# EAGLE design IO_BOARD_1 (EAGLE 5.01)

## Sheet 1 of 2
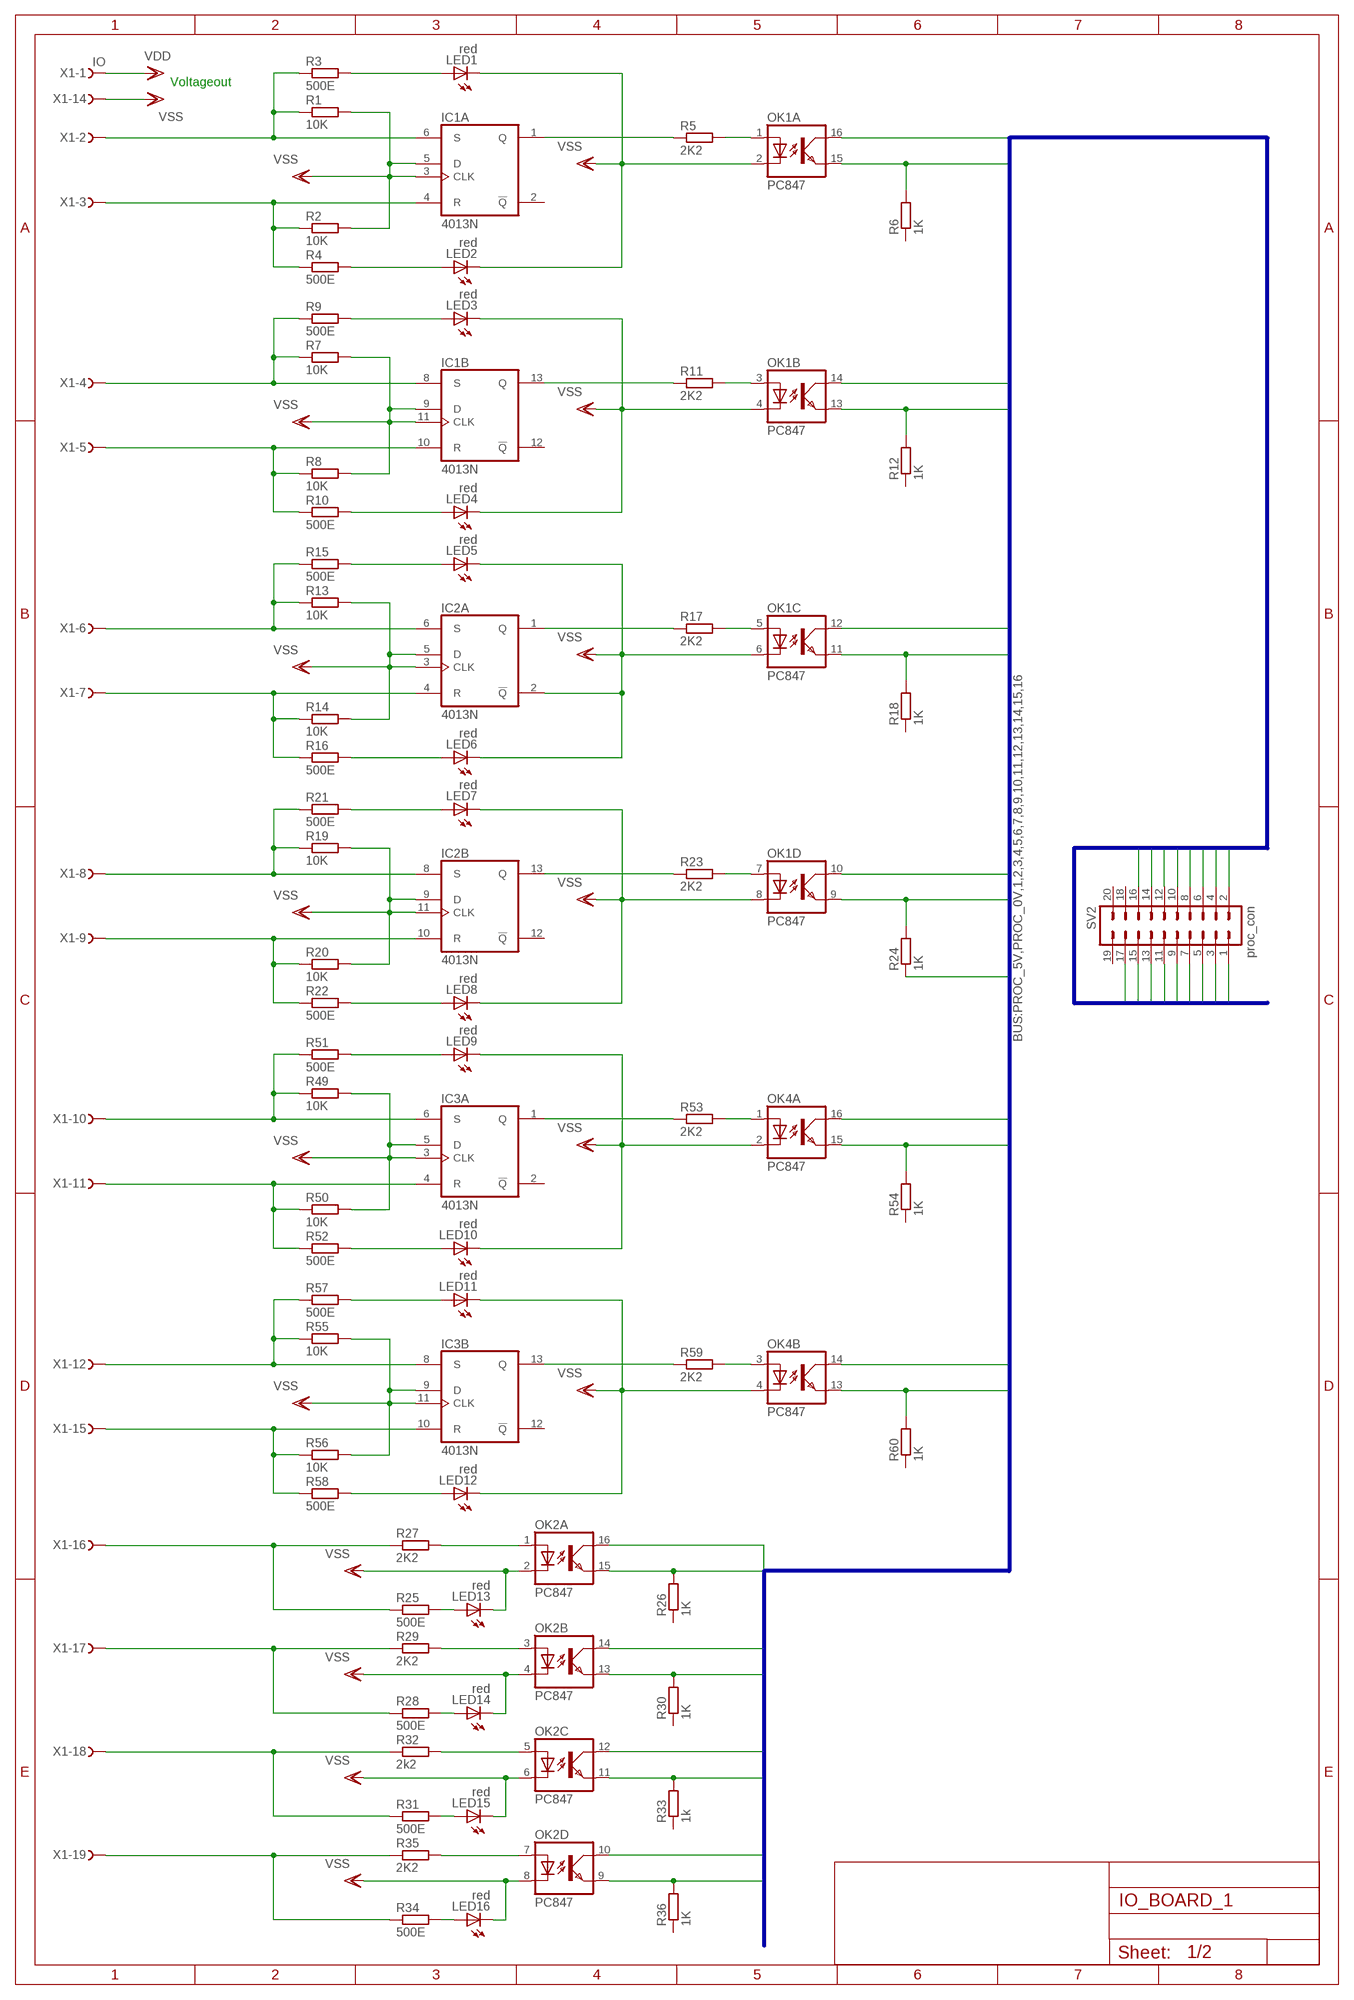
[diagram p0: schematic, sheet 1]

### Parts
IC1  4013N  [DIL14]
IC2  4013N  [DIL14]
IC3  4013N  [DIL14]
LED1  red  LED3MM  [LED3MM]
LED2  red  LED3MM  [LED3MM]
LED3  red  LED3MM  [LED3MM]
LED4  red  LED3MM  [LED3MM]
LED5  red  LED3MM  [LED3MM]
LED6  red  LED3MM  [LED3MM]
LED7  red  LED3MM  [LED3MM]
LED8  red  LED3MM  [LED3MM]
LED9  red  LED3MM  [LED3MM]
LED10  red  LED3MM  [LED3MM]
LED11  red  LED3MM  [LED3MM]
LED12  red  LED3MM  [LED3MM]
LED13  red  LED3MM  [LED3MM]
LED14  red  LED3MM  [LED3MM]
LED15  red  LED3MM  [LED3MM]
LED16  red  LED3MM  [LED3MM]
OK1  PC847  [DIL16]
OK2  PC847  [DIL16]
OK4  PC847  [DIL16]
R1  10K  R-EU_0207/10  [0207/10]
R2  10K  R-EU_0207/10  [0207/10]
R3  500E  R-EU_0207/10  [0207/10]
R4  500E  R-EU_0207/10  [0207/10]
R5  2K2  R-EU_0207/10  [0207/10]
R6  1K  R-EU_0207/10  [0207/10]
R7  10K  R-EU_0207/10  [0207/10]
R8  10K  R-EU_0207/10  [0207/10]
R9  500E  R-EU_0207/10  [0207/10]
R10  500E  R-EU_0207/10  [0207/10]
R11  2K2  R-EU_0207/10  [0207/10]
R12  1K  R-EU_0207/10  [0207/10]
R13  10K  R-EU_0207/10  [0207/10]
R14  10K  R-EU_0207/10  [0207/10]
R15  500E  R-EU_0207/10  [0207/10]
R16  500E  R-EU_0207/10  [0207/10]
R17  2K2  R-EU_0207/10  [0207/10]
R18  1K  R-EU_0207/10  [0207/10]
R19  10K  R-EU_0207/10  [0207/10]
R20  10K  R-EU_0207/10  [0207/10]
R21  500E  R-EU_0207/10  [0207/10]
R22  500E  R-EU_0207/10  [0207/10]
R23  2K2  R-EU_0207/10  [0207/10]
R24  1K  R-EU_0207/10  [0207/10]
R25  500E  R-EU_0207/10  [0207/10]
R26  1K  R-EU_0207/10  [0207/10]
R27  2K2  R-EU_0207/10  [0207/10]
R28  500E  R-EU_0207/10  [0207/10]
R29  2K2  R-EU_0207/10  [0207/10]
R30  1K  R-EU_0207/10  [0207/10]
R31  500E  R-EU_0207/10  [0207/10]
R32  2k2  R-EU_0207/10  [0207/10]
R33  1k  R-EU_0207/10  [0207/10]
R34  500E  R-EU_0207/10  [0207/10]
R35  2K2  R-EU_0207/10  [0207/10]
R36  1K  R-EU_0207/10  [0207/10]
R49  10K  R-EU_0207/10  [0207/10]
R50  10K  R-EU_0207/10  [0207/10]
R51  500E  R-EU_0207/10  [0207/10]
R52  500E  R-EU_0207/10  [0207/10]
R53  2K2  R-EU_0207/10  [0207/10]
R54  1K  R-EU_0207/10  [0207/10]
R55  10K  R-EU_0207/10  [0207/10]
R56  10K  R-EU_0207/10  [0207/10]
R57  500E  R-EU_0207/10  [0207/10]
R58  500E  R-EU_0207/10  [0207/10]
R59  2K2  R-EU_0207/10  [0207/10]
R60  1K  R-EU_0207/10  [0207/10]
SV2  proc_con  ML20  [ML20]
X1  IO  F25HPS  [F25HP]

### Nets
1: OK1.15(A:EMIT) R6.2 SV2.3
2: OK1.13(B:EMIT) R12.2 SV2.4
3: OK1.11(C:EMIT) R18.2 SV2.5
4: OK1.9(D:EMIT) R24.2 SV2.6
5: OK4.15(A:EMIT) R54.2 SV2.7
6: OK4.13(B:EMIT) R60.2 SV2.8
7: OK2.15(A:EMIT) R26.2 SV2.9
8: OK2.13(B:EMIT) R30.2 SV2.10
9: OK2.11(C:EMIT) R33.2 SV2.11
10: OK2.9(D:EMIT) R36.2 SV2.12
11: SV2.13 ; also sheet 2
12: SV2.14 ; also sheet 2
13: SV2.15 ; also sheet 2
14: SV2.16 ; also sheet 2
15: SV2.17 ; also sheet 2
N$1: IC1.6(A:S) R1.1 R3.1 X1.2(-2:F)
N$2: IC1.4(A:R) R2.1 R4.1 X1.3(-3:F)
N$3: LED1.A R3.2
N$4: LED2.A R4.2
N$5: OK1.1(A:A) R5.2
N$6: IC1.1(A:Q) R5.1
N$7: IC2.8(B:S) R19.1 R21.1 X1.8(-8:F)
N$8: IC2.10(B:R) R20.1 R22.1 X1.9(-9:F)
N$10: IC1.8(B:S) R7.1 R9.1 X1.4(-4:F)
N$11: IC1.10(B:R) R8.1 R10.1 X1.5(-5:F)
N$12: LED3.A R9.2
N$13: LED4.A R10.2
N$14: OK1.3(B:A) R11.2
N$15: IC1.13(B:Q) R11.1
N$17: IC2.6(A:S) R13.1 R15.1 X1.6(-6:F)
N$18: IC2.4(A:R) R14.1 R16.1 X1.7(-7:F)
N$19: LED5.A R15.2
N$20: LED6.A R16.2
N$21: OK1.5(C:A) R17.2
N$24: LED7.A R21.2
N$25: LED8.A R22.2
N$26: OK1.7(D:A) R23.2
N$27: IC2.13(B:Q) R23.1
N$28: IC2.1(A:Q) R17.1
N$29: OK2.1(A:A) R27.2
N$30: R25.1 R27.1 X1.16(-16:F)
N$31: OK2.3(B:A) R29.2
N$32: LED13.A R25.2
N$33: R28.1 R29.1 X1.17(-17:F)
N$35: LED14.A R28.2
N$37: OK2.5(C:A) R32.2
N$38: R31.1 R32.1 X1.18(-18:F)
N$39: LED15.A R31.2
N$41: OK2.7(D:A) R35.2
N$42: R34.1 R35.1 X1.19(-19:F)
N$43: LED16.A R34.2
N$61: IC3.6(A:S) R49.1 R51.1 X1.10(-10:F)
N$62: IC3.4(A:R) R50.1 R52.1 X1.11(-11:F)
N$63: LED9.A R51.2
N$64: LED10.A R52.2
N$65: OK4.1(A:A) R53.2
N$66: IC3.1(A:Q) R53.1
N$68: IC3.8(B:S) R55.1 R57.1 X1.12(-12:F)
N$69: IC3.10(B:R) R56.1 R58.1 X1.15(-15:F)
N$70: LED11.A R57.2
N$71: LED12.A R58.2
N$72: OK4.3(B:A) R59.2
N$73: IC3.13(B:Q) R59.1
PROC_0V: R24.1 SV2.2
PROC_5V: OK1.10(D:COL) OK1.12(C:COL) OK1.14(B:COL) OK1.16(A:COL) OK2.10(D:COL) OK2.12(C:COL) OK2.14(B:COL) OK2.16(A:COL) OK4.14(B:COL) OK4.16(A:COL) SV2.1 ; also sheet 2
VDD: X1.1(-1:F) ; also sheet 2
VSS: IC1.3(A:CLK) IC1.5(A:D) IC1.9(B:D) IC1.11(B:CLK) IC2.2(A:!Q) IC2.3(A:CLK) IC2.5(A:D) IC2.9(B:D) IC2.11(B:CLK) IC3.3(A:CLK) IC3.5(A:D) IC3.9(B:D) IC3.11(B:CLK) LED1.K(C) LED2.K(C) LED3.K(C) LED4.K(C) LED5.K(C) LED6.K(C) LED7.K(C) LED8.K(C) LED9.K(C) LED10.K(C) LED11.K(C) LED12.K(C) LED13.K(C) LED14.K(C) LED15.K(C) LED16.K(C) OK1.2(A:C) OK1.4(B:C) OK1.6(C:C) OK1.8(D:C) OK2.2(A:C) OK2.4(B:C) OK2.6(C:C) OK2.8(D:C) OK4.2(A:C) OK4.4(B:C) R1.2 R2.2 R7.2 R8.2 R13.2 R14.2 R19.2 R20.2 R49.2 R50.2 R55.2 R56.2 X1.14(-14:F) ; also sheet 2
Unconnected: IC1.2(A:!Q) IC1.12(B:!Q) IC2.12(B:!Q) IC3.2(A:!Q) IC3.12(B:!Q) R6.1 R12.1 R18.1 R26.1 R30.1 R33.1 R36.1 R54.1 R60.1 SV2.18 SV2.19 SV2.20

### Buses
BUS:PROC_5V,PROC_0V,1,2,3,4,5,6,7,8,9,10,11,12,13,14,15,16

### Notes on the sheet
- Voltageout

## Sheet 2 of 2
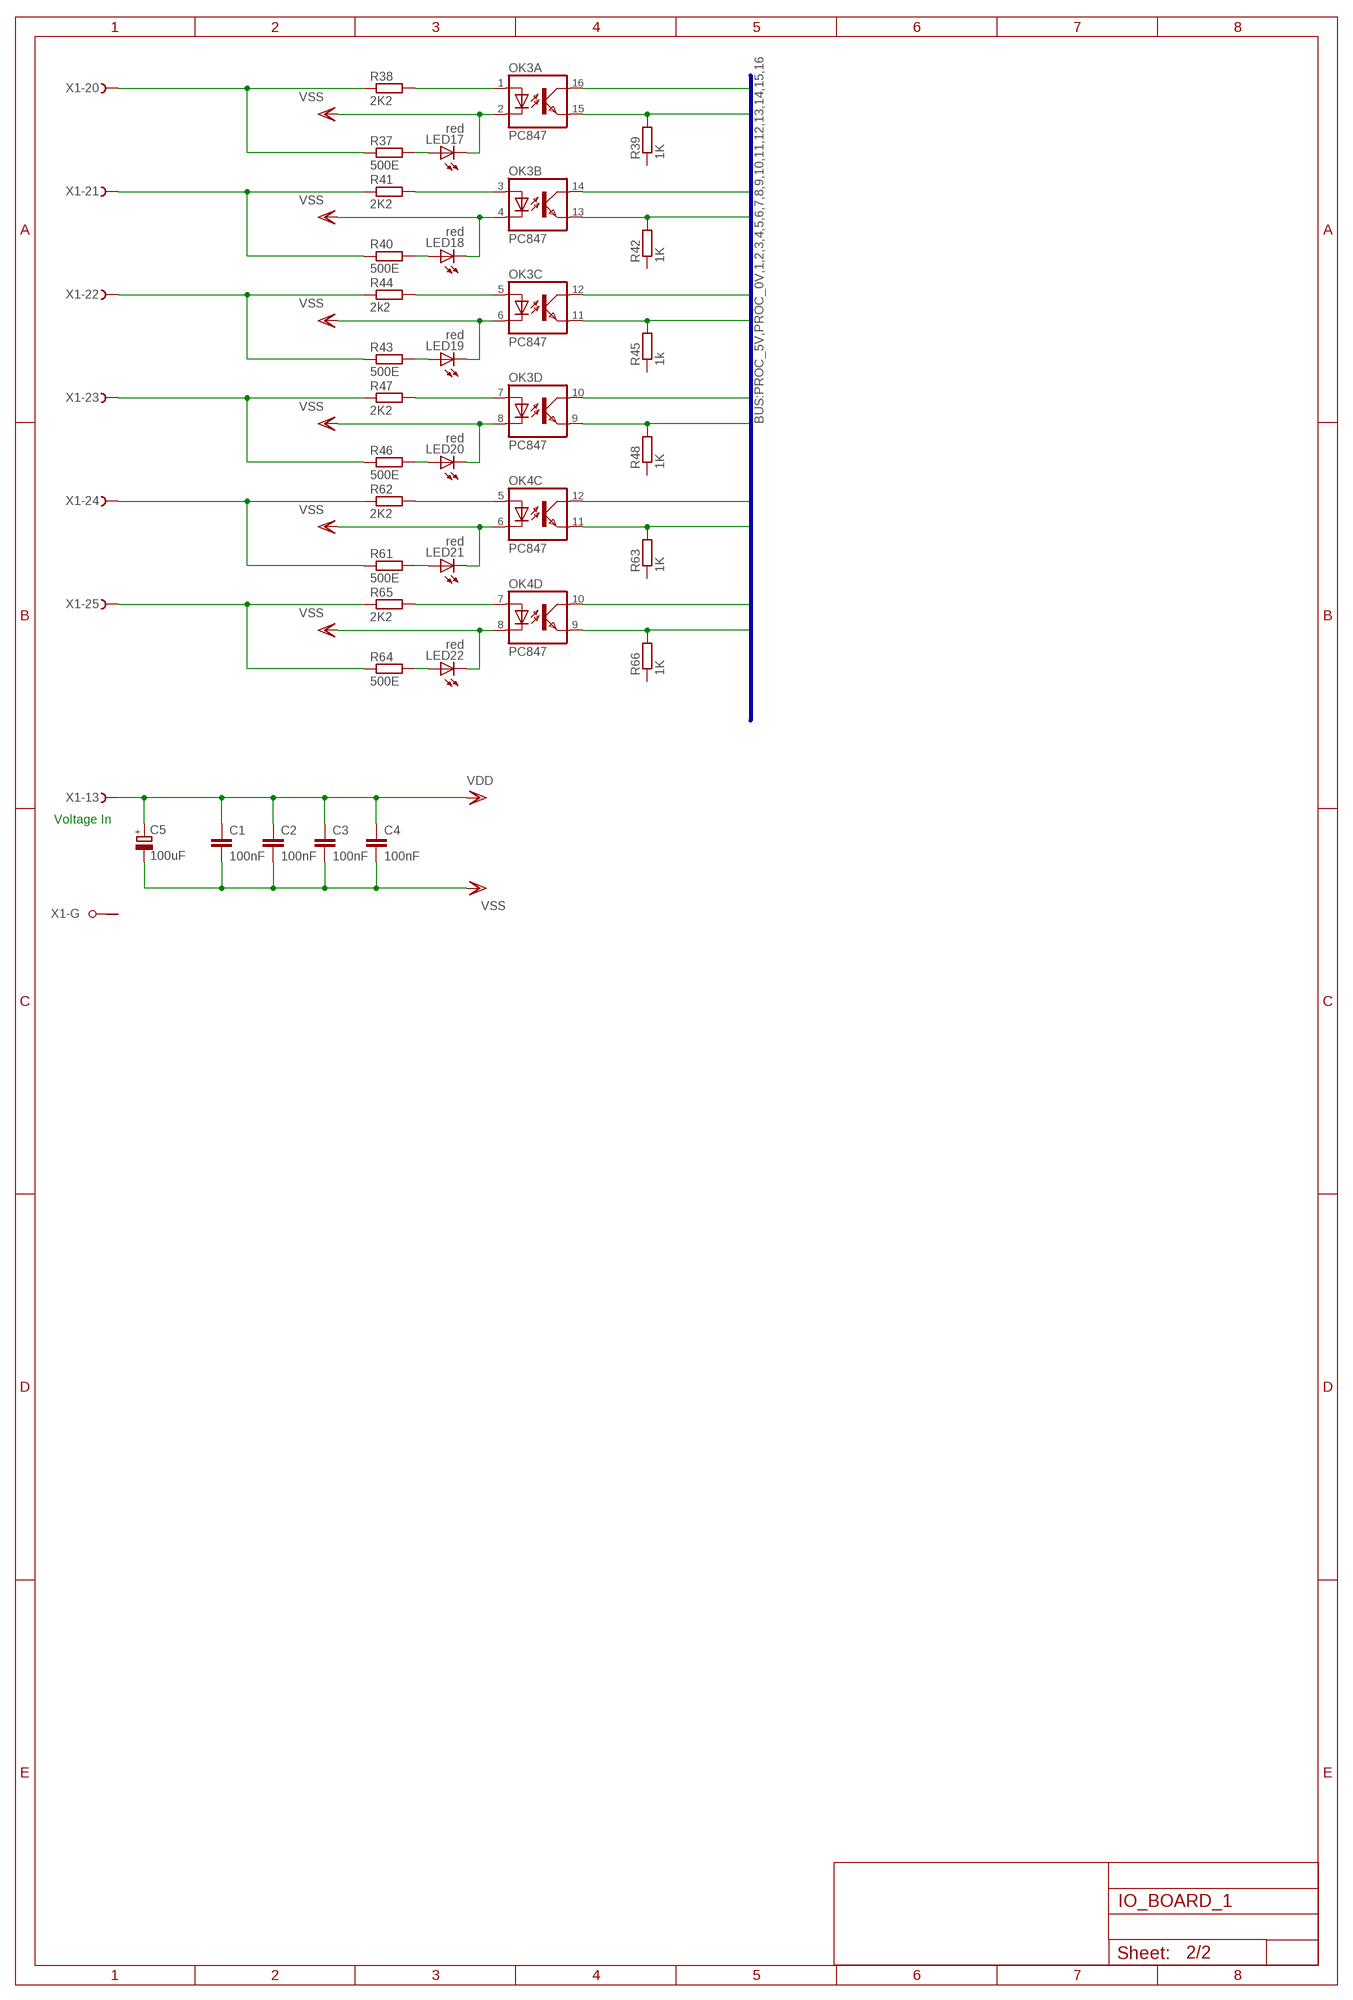
[diagram p1: schematic, sheet 2]

### Parts
C1  100nF  C-EU075-032X103  [C075-032X103]
C2  100nF  C-EU075-032X103  [C075-032X103]
C3  100nF  C-EU075-032X103  [C075-032X103]
C4  100nF  C-EU075-032X103  [C075-032X103]
C5  100uF  CPOL-EUE2.5-6  [E2,5-6]
LED17  red  LED3MM  [LED3MM]
LED18  red  LED3MM  [LED3MM]
LED19  red  LED3MM  [LED3MM]
LED20  red  LED3MM  [LED3MM]
LED21  red  LED3MM  [LED3MM]
LED22  red  LED3MM  [LED3MM]
OK3  PC847  [DIL16]
R37  500E  R-EU_0207/10  [0207/10]
R38  2K2  R-EU_0207/10  [0207/10]
R39  1K  R-EU_0207/10  [0207/10]
R40  500E  R-EU_0207/10  [0207/10]
R41  2K2  R-EU_0207/10  [0207/10]
R42  1K  R-EU_0207/10  [0207/10]
R43  500E  R-EU_0207/10  [0207/10]
R44  2k2  R-EU_0207/10  [0207/10]
R45  1k  R-EU_0207/10  [0207/10]
R46  500E  R-EU_0207/10  [0207/10]
R47  2K2  R-EU_0207/10  [0207/10]
R48  1K  R-EU_0207/10  [0207/10]
R61  500E  R-EU_0207/10  [0207/10]
R62  2K2  R-EU_0207/10  [0207/10]
R63  1K  R-EU_0207/10  [0207/10]
R64  500E  R-EU_0207/10  [0207/10]
R65  2K2  R-EU_0207/10  [0207/10]
R66  1K  R-EU_0207/10  [0207/10]

### Nets
11: OK3.15(A:EMIT) R39.2 ; also sheet 1
12: OK3.13(B:EMIT) R42.2 ; also sheet 1
13: OK3.11(C:EMIT) R45.2 ; also sheet 1
14: OK3.9(D:EMIT) R48.2 ; also sheet 1
15: OK4.11(C:EMIT) R63.2 ; also sheet 1
16: OK4.9(D:EMIT) R66.2
N$9: OK4.7(D:A) R65.2
N$16: R64.1 R65.1 X1.25(-25:F)
N$23: LED22.A R64.2
N$45: OK3.1(A:A) R38.2
N$46: R37.1 R38.1 X1.20(-20:F)
N$47: LED17.A R37.2
N$49: OK3.3(B:A) R41.2
N$50: R40.1 R41.1 X1.21(-21:F)
N$51: LED18.A R40.2
N$53: OK3.5(C:A) R44.2
N$54: R43.1 R44.1 X1.22(-22:F)
N$55: LED19.A R43.2
N$57: OK3.7(D:A) R47.2
N$58: R46.1 R47.1 X1.23(-23:F)
N$59: LED20.A R46.2
N$75: OK4.5(C:A) R62.2
N$76: R61.1 R62.1 X1.24(-24:F)
N$77: LED21.A R61.2
PROC_5V: OK3.10(D:COL) OK3.12(C:COL) OK3.14(B:COL) OK3.16(A:COL) OK4.10(D:COL) OK4.12(C:COL) ; also sheet 1
VDD: C1.1 C2.1 C3.1 C4.1 C5.+ X1.13(-13:F) ; also sheet 1
VSS: C1.2 C2.2 C3.2 C4.2 C5.- LED17.K(C) LED18.K(C) LED19.K(C) LED20.K(C) LED21.K(C) LED22.K(C) OK3.2(A:C) OK3.4(B:C) OK3.6(C:C) OK3.8(D:C) OK4.6(C:C) OK4.8(D:C) ; also sheet 1
Unconnected: R39.1 R42.1 R45.1 R48.1 R63.1 R66.1 X1.G1(-G:G1) X1.G2(-G:G2)

### Buses
BUS:PROC_5V,PROC_0V,1,2,3,4,5,6,7,8,9,10,11,12,13,14,15,16

### Notes on the sheet
- Voltage In

## Power pins joined to a net without a drawn wire
VDD: IC1.14(P:VDD) IC2.14(P:VDD) IC3.14(P:VDD)
VSS: IC1.7(P:VSS) IC2.7(P:VSS) IC3.7(P:VSS)

## Library data of the parts
C1-C4 = resistor:C-EU: CAPACITOR, European symbol
C5 = resistor:CPOL-EU: POLARIZED CAPACITOR, European symbol
IC1-IC3 = 40xx:4013: Dual D FLIP FLOP, set/reset
LED1-LED22 = led:LED: LED OSRAM: - CHIPLED LG R971, LG N971, LY N971, LG Q971, LY Q971, LO R971, LY R971 LH N974, LH R974 LS Q976, LO Q976, LY Q976 LO Q996 - Hyper CHIPLED LW Q18S LB Q993, LB Q99A, LB R99A - SideLED LS A670, LO A670, LY A670, LG A670, LP A670 LB A673, LV A673, LT A673, LW A673 LH A674 LY A675 LS A676, LA A676, LO A676, LY A676, LW A676 LS A679, LY A679, LG A679 - Hyper Micro SIDELED® LS Y876, LA Y876, LO Y876, LY Y876 LT Y87S - SmartLED LW L88C, LW L88S LB L89C, LB L89S, LG L890 LS L89K, LO L89K, LY L89K LS L896, LA L896, LO L896, LY L896 - TOPLED LS T670, LO T670, LY T670, LG T670, LP T670 LSG T670, LSP T670, LSY T670, LOP T670, LYG T670 LG T671, LOG T671, LSG T671 LB T673, LV T673, LT T673, LW T673 LH T674 LS T676, LA T676, LO T676, LY T676, LB T676, LH T676, LSB T676, LW T676 LB T67C, LV T67C, LT T67C, LS T67K, LO T67K, LY T67K, LW E67C LS E67B, LA E67B, LO E67B, LY E67B, LB E67C, LV E67C, LT E67C LW T67C LS T679, LY T679, LG T679 LS T770, LO T770, LY T770, LG T770, LP T770 LB T773, LV T773, LT T773, LW T773 LH T774 LS E675, LA E675, LY E675, LS T675 LS T776, LA T776, LO T776, LY T776, LB T776 LHGB T686 LT T68C, LB T68C - Hyper Mini TOPLED® LB M676 - Mini TOPLED Santana® LG M470 LS M47K, LO M47K, LY M47K Source: http://www.osram.convergy.de LUXEON: - LUMILED® LXK2-PW12-R00, LXK2-PW12-S00, LXK2-PW14-U00, LXK2-PW14-V00 LXK2-PM12-R00, LXK2-PM12-S00, LXK2-PM14-U00 LXK2-PE12-Q00, LXK2-PE12-R00, LXK2-PE12-S00, LXK2-PE14-T00, LXK2-PE14-U00 LXK2-PB12-K00, LXK2-PB12-L00, LXK2-PB12-M00, LXK2-PB14-N00, LXK2-PB14-P00, LXK2-PB14-Q00 LXK2-PR12-L00, LXK2-PR12-M00, LXK2-PR14-Q00, LXK2-PR14-R00 LXK2-PD12-Q00, LXK2-PD12-R00, LXK2-PD12-S00 LXK2-PH12-R00, LXK2-PH12-S00 LXK2-PL12-P00, LXK2-PL12-Q00, LXK2-PL12-R00 Source: www.luxeon.com KINGBRIGHT: KA-3528ASYC Source: www.kingbright.com
OK1-OK4 = optocoupler:PC847: SHARP OPTO COUPLER
R1-R66 = resistor:R-EU_: RESISTOR, European symbol
SV2 = con-harting-ml:ML20: HARTING
X1 = con-subd:F25HPS: SUB-D

## Board
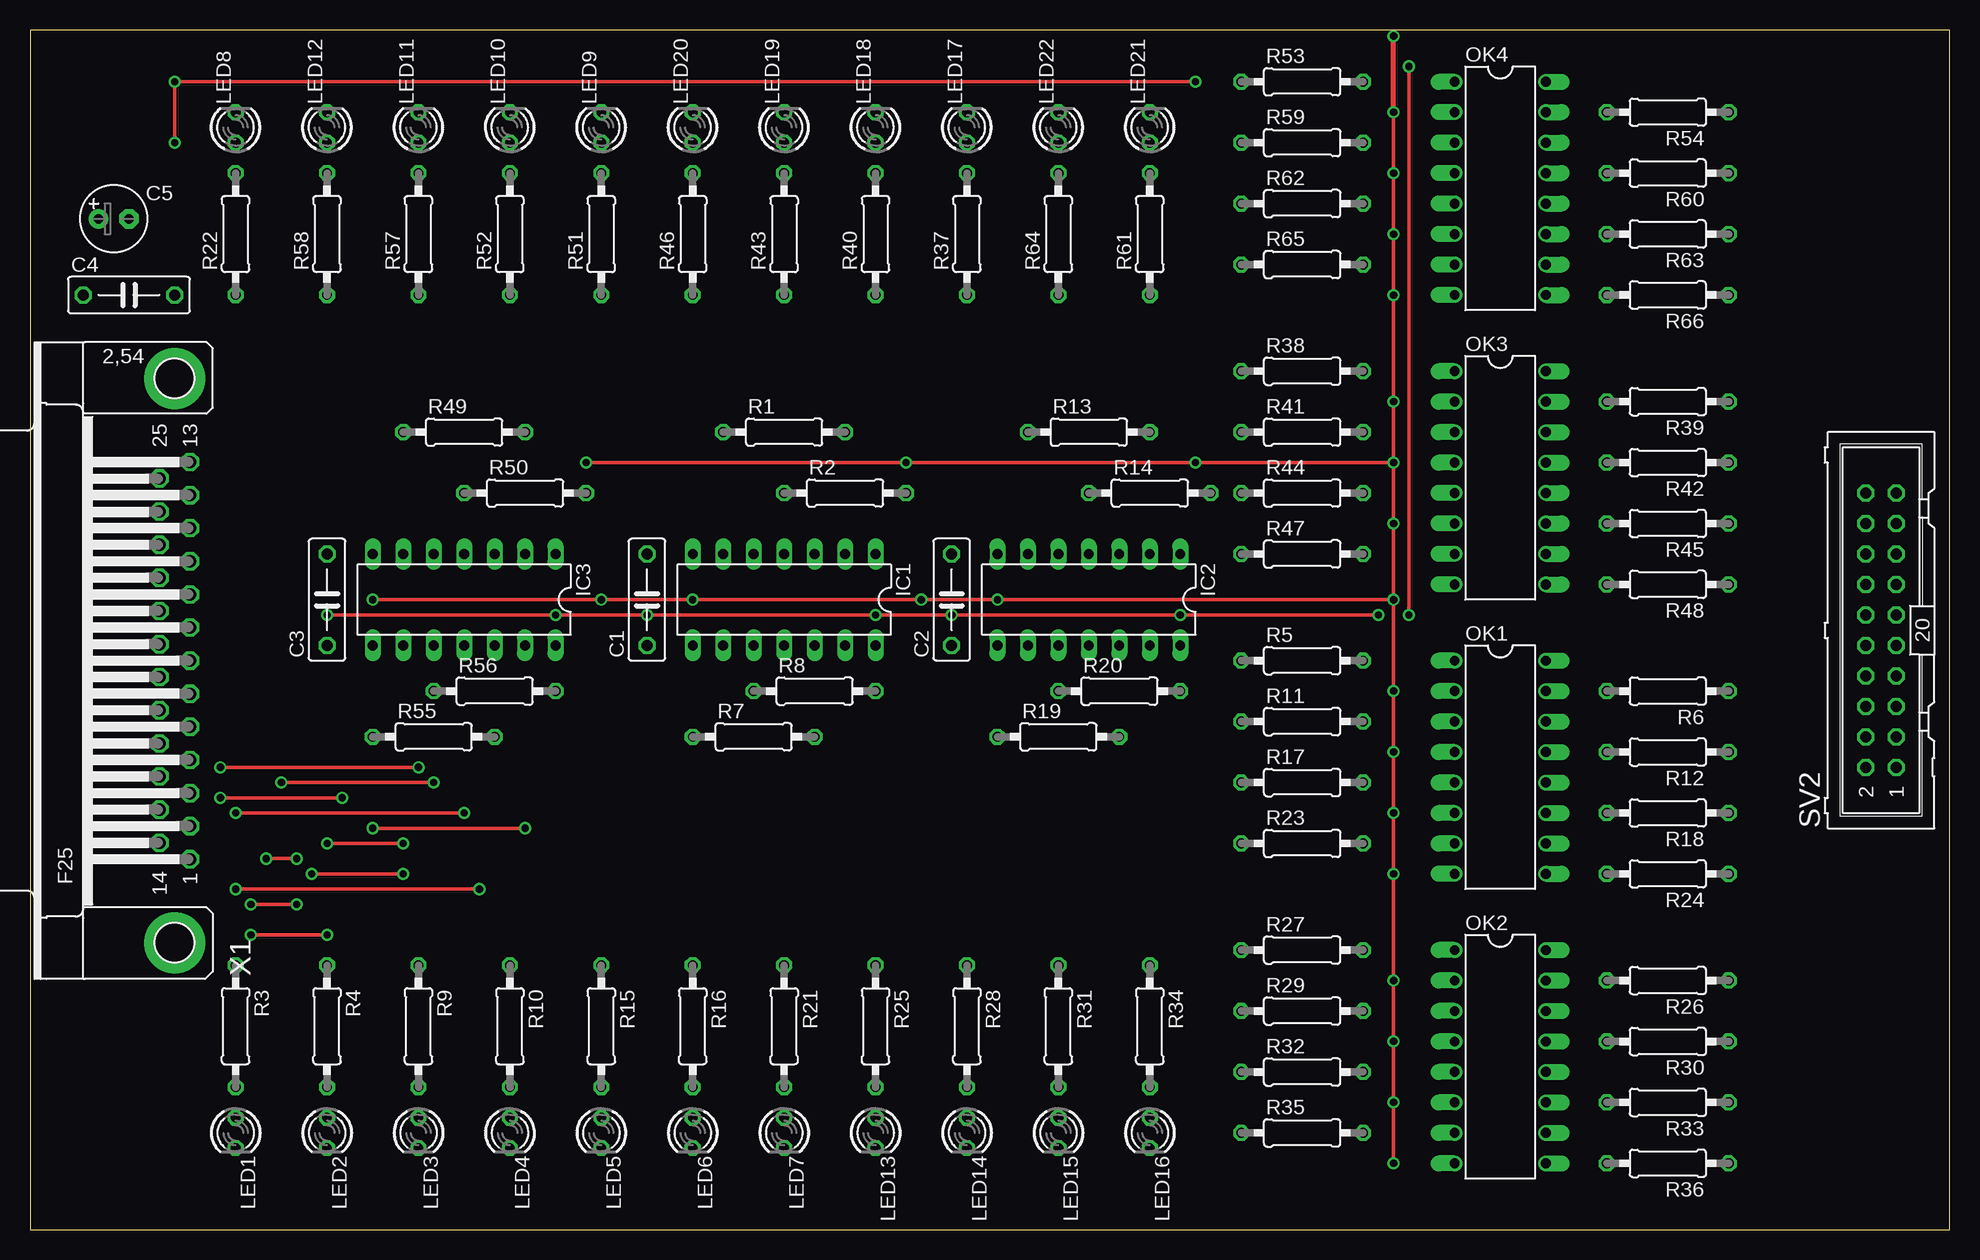
[diagram p2: board, top side]
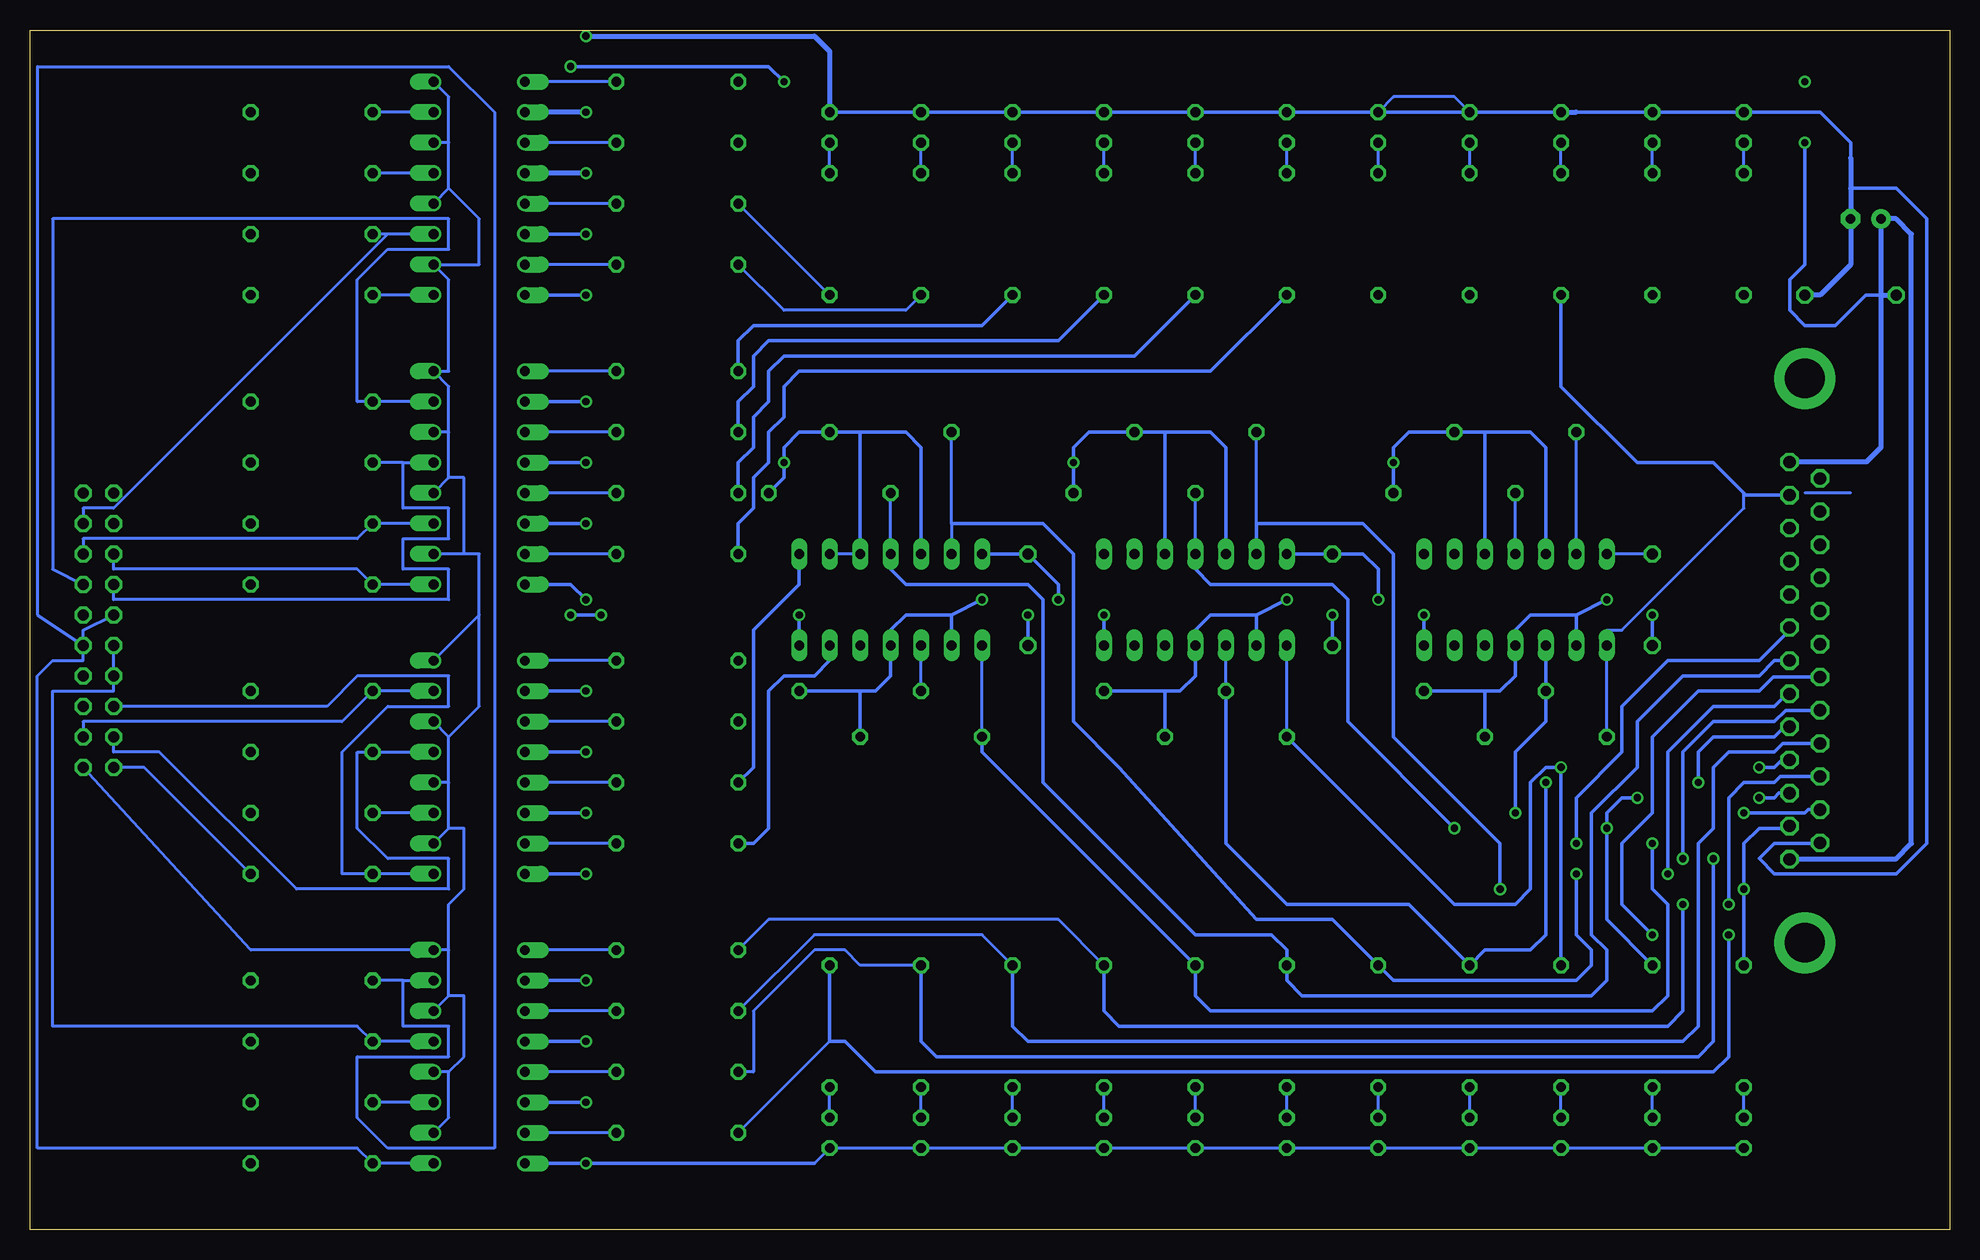
[diagram p3: board, bottom side, seen from below]

Size 160 x 100 mm. Coordinates in mm from the lower left corner, seen from the top.
Outline: 0,0 160,0 160,100 0,100 0,0
Copper layers (1*16): Top 0.035mm / dielectric 1.5mm / Bottom 0.035mm
Design rules "default": minimum track width 10mil, minimum drill 24mil, track to track 8mil, track to pad 8mil, pad to pad 8mil, via to via 8mil, smd to smd 8mil, copper to edge 40mil, drill to drill 8mil, minimum pad ring 10mil, minimum via ring 8mil, stop-mask expansion 4mil, vias tented up to drill 0mil, thermal gap 10mil

### Footprints (pad centres in the part's own frame; a part is rotated, then mirrored left to right if it is on the bottom)
C075-032X103 = drill 0.914 octagon: 1 -3.81,0; 2 3.81,0
E2,5-6 = drill 0.813 pad 1.6 round: + -1.27,0 | drill 0.813 pad 1.6 octagon: - 1.27,0
DIL14 = drill 0.813 long: 1 -7.62,-3.81; 2 -5.08,-3.81; 3 -2.54,-3.81; 4 0,-3.81; 5 2.54,-3.81; 6 5.08,-3.81; 7 7.62,-3.81; 8 7.62,3.81; 9 5.08,3.81; 10 2.54,3.81; 11 0,3.81; 12 -2.54,3.81; 13 -5.08,3.81; 14 -7.62,3.81
LED3MM = drill 0.813 octagon: A -1.27,0; K 1.27,0
DIL16 = drill 0.813 offset: 1 -8.89,-3.81; 2 -6.35,-3.81; 3 -3.81,-3.81; 4 -1.27,-3.81; 5 1.27,-3.81; 6 3.81,-3.81; 7 6.35,-3.81; 8 8.89,-3.81; 9 8.89,3.81; 10 6.35,3.81; 11 3.81,3.81; 12 1.27,3.81; 13 -1.27,3.81; 14 -3.81,3.81; 15 -6.35,3.81; 16 -8.89,3.81
0207/10 = drill 0.813 octagon: 1 -5.08,0; 2 5.08,0
ML20 = drill 0.914 octagon: 1 -11.43,-1.27; 2 -11.43,1.27; 3 -8.89,-1.27; 4 -8.89,1.27; 5 -6.35,-1.27; 6 -6.35,1.27; 7 -3.81,-1.27; 8 -3.81,1.27; 9 -1.27,-1.27; 10 -1.27,1.27; 11 1.27,-1.27; 12 1.27,1.27; 13 3.81,-1.27; 14 3.81,1.27; 15 6.35,-1.27; 16 6.35,1.27; 17 8.89,-1.27; 18 8.89,1.27; 19 11.43,-1.27; 20 11.43,1.27
F25HP = drill 1.016 octagon: 1 -16.561,-1.27; 2 -13.792,-1.27; 3 -11.049,-1.27; 4 -8.28,-1.27; 5 -5.512,-1.27; 6 -2.769,-1.27; 7 0,-1.27; 8 2.769,-1.27; 9 5.512,-1.27; 10 8.28,-1.27; 11 11.049,-1.27; 12 13.792,-1.27; 13 16.561,-1.27; 14 -15.189,1.27; 15 -12.421,1.27; 16 -9.652,1.27; 17 -6.909,1.27; 18 -4.14,1.27; 19 -1.372,1.27; 20 1.372,1.27; 21 4.14,1.27; 22 6.909,1.27; 23 9.652,1.27; 24 12.421,1.27; 25 15.189,1.27 | drill 3.302 pad 5.08 round: G1 -23.52,0; G2 23.52,0

### Placement (x,y rotation side)
C1  51.43,52.54 90 top
C2  76.83,52.54 90 top
C3  24.76,52.54 90 top
C4  8.25,77.94 0 top
C5  6.98,84.29 0 top
IC1  62.86,52.54 180 top
IC2  88.26,52.54 180 top
IC3  36.19,52.54 180 top
LED1  17.14,8.09 270 top
LED2  24.76,8.09 270 top
LED3  32.38,8.09 270 top
LED4  40,8.09 270 top
LED5  47.62,8.09 270 top
LED6  55.24,8.09 270 top
LED7  62.86,8.09 270 top
LED8  17.14,91.91 90 top
LED9  47.62,91.91 90 top
LED10  40,91.91 90 top
LED11  32.38,91.91 90 top
LED12  24.76,91.91 90 top
LED13  70.48,8.09 270 top
LED14  78.1,8.09 270 top
LED15  85.72,8.09 270 top
LED16  93.34,8.09 270 top
LED17  78.1,91.91 90 top
LED18  70.48,91.91 90 top
LED19  62.86,91.91 90 top
LED20  55.24,91.91 90 top
LED21  93.34,91.91 90 top
LED22  85.72,91.91 90 top
OK1  122.55,38.57 270 top
OK2  122.55,14.44 270 top
OK3  122.55,62.7 270 top
OK4  122.55,86.83 270 top
R1  62.86,66.51 0 top
R2  67.94,61.43 0 top
R3  17.14,16.98 270 top
R4  24.76,16.98 270 top
R5  106.04,47.46 0 top
R6  136.52,44.92 180 top
R7  60.32,41.11 0 top
R8  65.4,44.92 0 top
R9  32.38,16.98 270 top
R10  40,16.98 270 top
R11  106.04,42.38 0 top
R12  136.52,39.84 180 top
R13  88.26,66.51 0 top
R14  93.34,61.43 0 top
R15  47.62,16.98 270 top
R16  55.24,16.98 270 top
R17  106.04,37.3 0 top
R18  136.52,34.76 180 top
R19  85.72,41.11 0 top
R20  90.8,44.92 0 top
R21  62.86,16.98 270 top
R22  17.14,83.02 90 top
R23  106.04,32.22 0 top
R24  136.52,29.68 180 top
R25  70.48,16.98 270 top
R26  136.52,20.79 180 top
R27  106.04,23.33 0 top
R28  78.1,16.98 270 top
R29  106.04,18.25 0 top
R30  136.52,15.71 180 top
R31  85.72,16.98 270 top
R32  106.04,13.17 0 top
R33  136.52,10.63 180 top
R34  93.34,16.98 270 top
R35  106.04,8.09 0 top
R36  136.52,5.55 180 top
R37  78.1,83.02 90 top
R38  106.04,71.59 0 top
R39  136.52,69.05 180 top
R40  70.48,83.02 90 top
R41  106.04,66.51 0 top
R42  136.52,63.97 180 top
R43  62.86,83.02 90 top
R44  106.04,61.43 0 top
R45  136.52,58.89 180 top
R46  55.24,83.02 90 top
R47  106.04,56.35 0 top
R48  136.52,53.81 180 top
R49  36.19,66.51 0 top
R50  41.27,61.43 0 top
R51  47.62,83.02 90 top
R52  40,83.02 90 top
R53  106.04,95.72 0 top
R54  136.52,93.18 180 top
R55  33.65,41.11 0 top
R56  38.73,44.92 0 top
R57  32.38,83.02 90 top
R58  24.76,83.02 90 top
R59  106.04,90.64 0 top
R60  136.52,88.1 180 top
R61  93.34,83.02 90 top
R62  106.04,85.56 0 top
R63  136.52,83.02 180 top
R64  85.72,83.02 90 top
R65  106.04,80.48 0 top
R66  136.52,77.94 180 top
SV2  154.3,50 90 top
X1  12.06,47.46 90 top

### Tracks (layer width: path | path; a pad name or v marks a point on that pad's centre or on a via)
1
  Bottom 0.254: OK1.15 R6.2 133.98,42.38 155.57,42.38 SV2.3
2
  Bottom 0.254: OK1.13 R12.2 132.71,39.84 132.71,33.49 130.17,30.95 125.09,30.95 125.09,28.41 137.79,28.41 149.22,39.84 153.03,39.84 SV2.4
3
  Bottom 0.254: OK1.11 R18.2
4
  Bottom 0.254: OK1.9 R24.2 133.98,29.68 133.98,39.84 130.17,43.65 125.09,43.65 125.09,46.19 132.71,46.19 135.25,43.65 SV2.6
5
  Bottom 0.254: OK4.15 R54.2
6
  Bottom 0.254: OK4.13 R60.2
7
  Bottom 0.254: 128.9,20.79 R26.2 | 128.9,20.79 OK2.15 | SV2.9 159.38,51.27 159.38,96.99 125.09,96.99 121.28,93.18 121.28,6.82 130.17,6.82 132.71,9.36 132.71,14.44 125.09,14.44 125.09,16.98 128.9,16.98 128.9,20.79
8
  Bottom 0.254: OK2.13 R30.2 132.71,16.98 158.11,16.98 158.11,44.92 153.03,44.92 SV2.10
9
  Bottom 0.254: OK2.11 R33.2
10
  Bottom 0.254: OK2.9 R36.2 132.71,6.82 159.38,6.82 159.38,46.19 158.11,47.46 155.57,47.46 155.57,50 SV2.12
11
  Bottom 0.254: OK3.15 R39.2 132.71,69.05 132.71,79.21 130.17,81.75 125.09,81.75 125.09,84.29 158.11,84.29 158.11,55.08 SV2.13
12
  Bottom 0.254: 128.9,63.97 R42.2 | 128.9,63.97 OK3.13 | SV2.14 153.03,52.54 125.09,52.54 125.09,55.08 128.9,55.08 128.9,57.62 125.09,57.62 125.09,60.16 128.9,60.16 128.9,63.97
13
  Bottom 0.254: OK3.11 R45.2 132.71,57.62 155.57,57.62 SV2.15
14
  Bottom 0.254: OK3.9 R48.2 132.71,55.08 153.03,55.08 SV2.16
15
  Bottom 0.254: 130.17,83.02 R63.2 | OK4.11 130.17,83.02 | SV2.17 155.57,60.16 153.03,60.16 130.17,83.02
16
  Bottom 0.254: OK4.9 R66.2
N$1  (via drill 0.6)
  Top 0.305: v17.14,28.41 v37.46,28.41
  Bottom 0.254: 57.78,58.89 R1.1
  Bottom 0.305: R3.1 v17.14,28.41 17.14,32.22 15.87,33.49 13.33,33.49 X1.2 | IC1.6 57.78,58.89 48.89,58.89 46.35,56.35 46.35,41.11 37.46,32.22 v37.46,28.41
N$2  (via drill 0.6)
  Top 0.305: v26.03,36.03 v15.87,36.03 | v28.57,33.49 v41.27,33.49
  Bottom 0.254: IC1.4 R2.1
  Bottom 0.305: X1.3 14.22,36.41 14.6,36.03 v15.87,36.03 | R4.1 28.57,25.87 v28.57,33.49 28.57,34.76 27.3,36.03 v26.03,36.03 | IC1.4 62.86,55.08 61.59,53.81 51.43,53.81 50.16,52.54 50.16,42.38 v41.27,33.49
N$3
  Bottom 0.254: LED1.A R3.2
N$4
  Bottom 0.254: LED2.A R4.2
N$5
  Bottom 0.254: R5.2 OK1.1
N$7  (via drill 0.6)
  Top 0.305: v24.76,32.22 v31.11,32.22
  Bottom 0.254: R19.1 IC2.8
  Bottom 0.305: R19.1 80.64,39.84 R21.1 62.86,19.52 61.59,18.25 24.76,18.25 23.49,19.52 23.49,27.14 24.76,28.41 v24.76,32.22 | X1.8 13.33,50 15.87,47.46 23.49,47.46 27.3,43.65 27.3,39.84 31.11,36.03 v31.11,32.22
N$8
  Bottom 0.254: R20.1 IC2.10
N$9
  Bottom 0.254: R65.2 OK4.7
N$10  (via drill 0.6)
  Top 0.305: v15.87,38.57 v32.38,38.57
  Bottom 0.254: R7.1 IC1.8
  Bottom 0.305: X1.4 13.99,39.18 14.6,38.57 v15.87,38.57 | R9.1 v32.38,38.57 33.65,38.57 34.92,37.3 34.92,28.41 36.19,27.14 41.27,27.14 R7.1
N$11  (via drill 0.6)
  Top 0.305: v20.95,37.3 v33.65,37.3
  Bottom 0.254: R8.1 IC1.10
  Bottom 0.305: X1.5 13.76,41.95 14.6,41.11 19.68,41.11 20.95,39.84 v20.95,37.3 | R8.1 60.32,32.22 55.24,27.14 45.08,27.14 R10.1 38.73,23.33 34.92,23.33 33.65,24.6 v33.65,37.3
N$12
  Bottom 0.254: LED3.A R9.2
N$13
  Bottom 0.254: LED4.A R10.2
N$14
  Bottom 0.254: R11.2 OK1.3
N$16
  Bottom 0.254: R64.1 86.99,76.67 97.15,76.67 R65.1
N$17  (via drill 0.6)
  Top 0.305: v31.11,29.68 v23.49,29.68
  Bottom 0.254: IC2.6 83.18,58.89 R13.1
  Bottom 0.305: X1.6 13.56,44.69 14.6,43.65 19.68,43.65 23.49,39.84 v23.49,29.68 | 83.18,58.89 75.56,58.89 73.02,56.35 73.02,42.38 69.21,38.57 57.78,25.87 51.43,25.87 R15.1 46.35,20.79 31.11,20.79 29.84,22.06 29.84,23.33 31.11,24.6 v31.11,29.68
N$18
  Bottom 0.254: IC2.4 R14.1
  Bottom 0.305: IC2.4 88.26,55.08 86.99,53.81 76.83,53.81 75.56,52.54 75.56,37.3 62.86,24.6 56.51,24.6 55.24,23.33 | 55.24,23.33 R16.1 | X1.7 14.6,47.46 15.87,46.19 22.22,46.19 26.03,42.38 26.03,38.57 29.84,34.76 29.84,24.6 28.57,23.33 28.57,20.79 29.84,19.52 53.97,19.52 55.24,20.79 55.24,23.33
N$19
  Bottom 0.254: LED5.A R15.2
N$20
  Bottom 0.254: LED6.A R16.2
N$21
  Bottom 0.254: R17.2 OK1.5
N$23
  Bottom 0.254: R64.2 LED22.A
N$24
  Bottom 0.254: LED7.A R21.2
N$25
  Bottom 0.254: R22.2 LED8.A
N$26
  Bottom 0.254: R23.2 OK1.7
N$27
  Bottom 0.305: IC2.13 93.34,47.46 94.61,46.19 97.15,46.19 98.42,44.92 98.42,33.49 99.69,32.22 R23.1
N$28
  Bottom 0.305: IC2.1 95.88,53.81 99.69,50 99.69,38.57 R17.1
N$29
  Bottom 0.254: R27.2 OK2.1
N$30  (via drill 0.6)
  Top 0.305: v22.22,27.14 v18.41,27.14
  Bottom 0.254: R25.1 74.29,25.87 98.42,25.87 R27.1
  Bottom 0.305: X1.16 14.09,37.81 14.6,37.3 17.14,37.3 18.41,36.03 v18.41,27.14 | R25.1 70.48,18.25 69.21,16.98 23.49,16.98 22.22,18.25 v22.22,27.14
N$31
  Bottom 0.254: R29.2 OK2.3
N$32
  Bottom 0.254: LED13.A R25.2
N$33
  Bottom 0.254: R28.1 80.64,24.6 94.61,24.6 R29.1
  Bottom 0.305: X1.17 13.89,40.55 14.6,39.84 18.41,39.84 19.68,38.57 19.68,33.49 20.95,32.22 20.95,16.98 22.22,15.71 76.83,15.71 78.1,16.98 R28.1
N$35
  Bottom 0.254: LED14.A R28.2
N$37
  Bottom 0.254: R32.2 OK2.5
N$38  (via drill 0.6)
  Top 0.305: v19.68,30.95 v22.22,30.95
  Bottom 0.254: R31.1 90.8,22.06 92.07,23.33 94.61,23.33 99.69,18.25 99.69,13.17 R32.1
  Bottom 0.305: X1.18 13.66,43.32 14.6,42.38 19.68,42.38 22.22,39.84 v22.22,30.95 | R31.1 85.72,15.71 84.45,14.44 20.95,14.44 19.68,15.71 v19.68,30.95
N$39
  Bottom 0.254: LED15.A R31.2
N$41
  Bottom 0.254: R35.2 OK2.7
N$42  (via drill 0.6)
  Top 0.305: v18.41,24.6 v24.76,24.6
  Bottom 0.254: 93.34,15.71 R35.1
  Bottom 0.305: X1.19 14.7,46.09 15.87,44.92 20.95,44.92 24.76,41.11 24.76,34.76 27.3,32.22 27.3,27.14 v24.76,24.6 | R34.1 93.34,15.71 92.07,15.71 89.53,13.17 19.68,13.17 18.41,14.44 v18.41,24.6
N$43
  Bottom 0.254: LED16.A R34.2
N$45
  Bottom 0.254: R38.2 OK3.1
N$46
  Bottom 0.254: X1.20 10.79,48.73
  Bottom 0.305: R38.1 100.96,74.13 99.69,75.4 80.64,75.4 R37.1
N$47
  Bottom 0.254: R37.2 LED17.A
N$49
  Bottom 0.254: R41.2 OK3.3
N$50
  Bottom 0.305: R41.1 100.96,69.05 99.69,70.32 99.69,72.86 98.42,74.13 74.29,74.13 R40.1
N$51
  Bottom 0.254: R40.2 LED18.A
N$53
  Bottom 0.254: R44.2 OK3.5
N$54
  Bottom 0.305: R44.1 100.96,63.97 99.69,65.24 99.69,67.78 98.42,69.05 98.42,71.59 97.15,72.86 67.94,72.86 R43.1
N$55
  Bottom 0.254: R43.2 LED19.A
N$57
  Bottom 0.254: R47.2 OK3.7
N$58
  Bottom 0.305: R47.1 100.96,58.89 99.69,60.16 99.69,62.7 98.42,63.97 98.42,66.51 97.15,67.78 97.15,70.32 95.88,71.59 61.59,71.59 R46.1
N$59
  Bottom 0.254: R46.2 LED20.A
N$61
  Bottom 0.254: IC3.6 R49.1
N$62
  Bottom 0.254: IC3.4 R50.1 | X1.11 13.33,58.89
N$63
  Bottom 0.254: R51.2 LED9.A
N$64
  Bottom 0.254: R52.2 LED10.A
N$65
  Bottom 0.254: R53.2 OK4.1
N$68
  Bottom 0.254: R55.1 IC3.8 28.57,50 27.3,50 17.14,60.16 17.14,61.43
  Bottom 0.305: X1.12 16.96,61.25 17.14,61.43 19.68,63.97 26.03,63.97 32.38,70.32 R57.1
N$69  (via drill 0.6)
  Top 0.305: v17.14,34.76 v36.19,34.76
  Bottom 0.305: IC3.10 R56.1 33.65,42.38 36.19,39.84 v36.19,34.76 | X1.15 11.78,35.04 12.06,34.76 v17.14,34.76
N$70
  Bottom 0.254: R57.2 LED11.A
N$71
  Bottom 0.254: R58.2 LED12.A
N$72
  Bottom 0.254: R59.2 OK4.3
N$75
  Bottom 0.254: R62.2 OK4.5
N$76
  Bottom 0.254: R61.1 R62.1
N$77
  Bottom 0.254: R61.2 LED21.A
PROC_0V
  Bottom 0.254: R24.1 150.49,38.57 SV2.2
PROC_5V
  Bottom 0.254: OK2.10 125.09,9.36 125.09,13.17 | 125.09,13.17 OK2.12 | 125.09,19.52 OK2.14 | 125.09,19.52 125.09,23.33 | 125.09,23.33 OK2.16 141.6,23.33 SV2.1 | 125.09,13.17 123.82,14.44 123.82,19.52 125.09,19.52 | 125.09,33.49 OK1.10 | 125.09,33.49 125.09,37.3 | 125.09,37.3 OK1.12 | 125.09,41.11 OK1.14 | 125.09,37.3 125.09,41.11 | 122.55,51.27 OK1.16 | 122.55,51.27 122.55,56.35 123.82,56.35 | 123.82,56.35 OK3.10 | 125.09,41.11 122.55,43.65 122.55,51.27 | 125.09,86.83 OK4.12 | 125.09,86.83 125.09,90.64 | 125.09,90.64 OK4.14 | OK4.16 125.09,94.45 125.09,90.64 | 125.09,62.7 OK3.12 | 125.09,62.7 125.09,66.51 | 125.09,66.51 OK3.14 | 125.09,66.51 125.09,70.32 OK3.16 125.09,71.59 125.09,79.21 OK4.10 122.55,80.48 122.55,84.29 125.09,86.83 | 123.82,56.35 123.82,62.7 125.09,62.7 | 125.09,23.33 125.09,27.14 123.82,28.41 123.82,33.49 125.09,33.49
VDD  (via drill 0.6)
  Top 0.305: v12.06,90.64 v12.06,95.72 v97.15,95.72 | v114.93,96.99 v114.93,51.27 | v112.39,51.27 v95.88,51.27 v76.83,51.27 v70.48,51.27 v51.43,51.27 v43.81,51.27 v24.76,51.27
  Bottom 0.305: v12.06,90.64 12.06,80.48 13.33,79.21 13.33,76.67 12.06,75.4 9.52,75.4 6.98,77.94 5.71,77.94 | v114.93,96.99 98.42,96.99 v97.15,95.72 | v114.93,51.27 v112.39,51.27 | v24.76,51.27 C3.1 | v43.81,51.27 IC3.14 | v51.43,51.27 C1.1 | v70.48,51.27 IC1.14 | v76.83,51.27 C2.1 | v95.88,51.27 IC2.14
  Bottom 0.406: X1.1 4.49,30.9 3.17,32.22 3.17,83.02 4.44,84.29 C5.+ 5.71,77.94 | 5.71,77.94 C4.1 | X1.13 6.93,64.02 5.71,65.24 5.71,77.94
VSS  (via drill 0.6)
  Top 0.305: v113.66,93.18 v113.66,88.1 v113.66,83.02 v113.66,77.94 v113.66,69.05 v113.66,63.97 | v113.66,63.97 v113.66,58.89 v113.66,52.54 | v113.66,52.54 v113.66,44.92 v113.66,39.84 v113.66,34.76 v113.66,29.68 v113.66,20.79 v113.66,15.71 v113.66,10.63 v113.66,5.55 | v113.66,52.54 v80.64,52.54 v74.29,52.54 v55.24,52.54 v47.62,52.54 v28.57,52.54 | v113.66,63.97 v97.15,63.97 v73.02,63.97 v46.35,63.97
  Top 0.406: v113.66,93.18 v113.66,99.53
  Bottom 0.254: 8.25,61.43 12.06,61.43 | 10.79,32.22 X1.14 | C3.2 IC3.7 | IC2.3 IC2.2 | LED1.K LED2.K LED3.K LED4.K LED5.K LED6.K LED7.K LED13.K LED14.K LED15.K LED16.K 94.61,5.55 | LED9.K 46.35,94.45 41.27,94.45 LED10.K
  Bottom 0.305: OK2.8 v113.66,5.55 94.61,5.55 | v113.66,10.63 OK2.6 | v113.66,15.71 OK2.4 | v113.66,20.79 OK2.2 | v113.66,29.68 OK1.8 | v113.66,34.76 OK1.6 | v113.66,39.84 OK1.4 | v113.66,44.92 OK1.2 | v113.66,58.89 OK3.6 | v113.66,63.97 OK3.4 | v113.66,69.05 OK3.2 | v113.66,77.94 OK4.8 | v113.66,83.02 OK4.6 | 8.25,89.37 8.25,90.64 10.79,93.18 LED8.K LED10.K LED9.K LED21.K | 10.79,32.22 14.6,32.22 15.87,30.95 14.6,29.68 4.44,29.68 1.9,32.22 1.9,84.29 4.44,86.83 8.25,86.83 | 31.11,51.27 IC3.9 | v28.57,52.54 31.11,51.27 | 38.73,44.92 37.46,44.92 36.19,46.19 IC3.11 36.19,50 34.92,51.27 31.11,51.27 | 38.73,44.92 R56.2 | 38.73,44.92 R55.2 | 65.4,44.92 64.13,44.92 62.86,46.19 IC1.11 62.86,50 61.59,51.27 57.78,51.27 | 65.4,44.92 R8.2 | 65.4,44.92 R7.2 | 90.8,44.92 89.53,44.92 88.26,46.19 IC2.11 88.26,50 86.99,51.27 83.18,51.27 | 90.8,44.92 R20.2 | 90.8,44.92 R19.2 | 57.78,51.27 IC1.9 | v55.24,52.54 57.78,51.27 | 83.18,51.27 IC2.9 | v80.64,52.54 83.18,51.27 | v113.66,52.54 114.93,53.81 OK3.8 | v74.29,52.54 74.29,53.81 C2.2 IC2.7 | IC3.5 33.65,65.24 34.92,66.51 38.73,66.51 | 38.73,66.51 R49.2 45.08,66.51 46.35,65.24 v46.35,63.97 R50.2 | IC1.5 60.32,65.24 61.59,66.51 65.4,66.51 | 65.4,66.51 R1.2 71.75,66.51 73.02,65.24 v73.02,63.97 R2.2 | 65.4,66.51 IC1.3 | 38.73,66.51 IC3.3 | IC2.5 85.72,65.24 86.99,66.51 90.8,66.51 | 90.8,66.51 R13.2 95.88,66.51 97.15,65.24 v97.15,63.97 97.15,62.7 R14.2 | 90.8,66.51 IC2.3 | v47.62,52.54 47.62,55.08 48.89,56.35 C1.2 IC1.7
  Bottom 0.406: C4.2 10.79,77.94 8.25,80.48 C5.- 8.25,86.83 8.25,89.37 | LED11.K 31.11,93.18 | v113.66,93.18 OK4.2 | v113.66,88.1 OK4.4 | LED21.K 93.34,98.26 94.61,99.53 v113.66,99.53